# Altium schematic sheet Fluid_RTD_FE.SchDoc
size A4; SheetNumber: 4; SheetTotal: 5
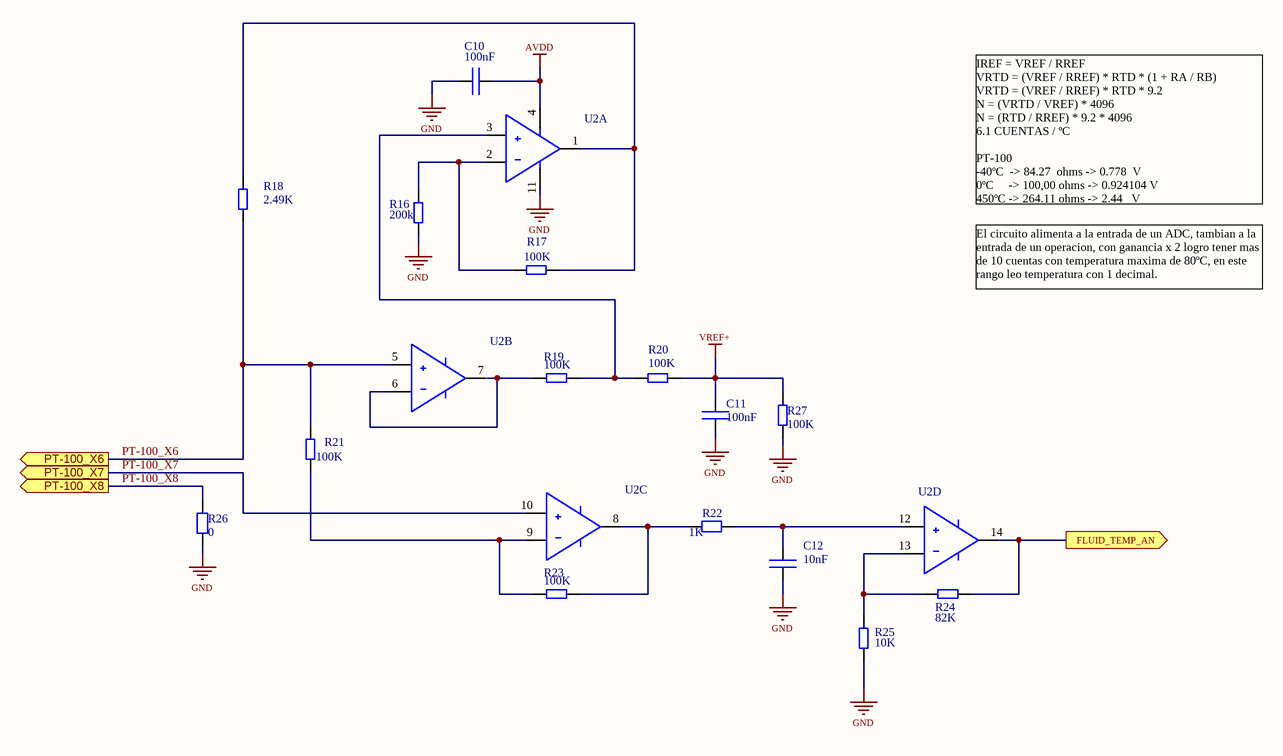
[diagram p0: Fluid_RTD_FE.SchDoc]

## Parts
C10  100nF  [CAP_SM0603_YAGEOCC2_N]
C11  100nF  [CAP_SM0603_YAGEOCC2_N]
C12  10nF  [CAP_SM0603_YAGEOCC2_N]
R16  200k  [RES_SM0603_YAGEORC_N]
R17  100K  [RES_SM0603_YAGEORC_N]
R18  2.49K  [RES_SM0603_YAGEORC_N]
R19  100K  [RES_SM0603_YAGEORC_N]
R20  100K  [RES_SM0603_YAGEORC_N]
R21  100K  [RES_SM0603_YAGEORC_N]
R22  1K  [RES_SM0603_YAGEORC_N]
R23  100K  [RES_SM0603_YAGEORC_N]
R24  82K  [RES_SM0603_YAGEORC_N]
R25  10K  [RES_SM0603_YAGEORC_N]
R26  0  [RES_SM0603_YAGEORC_N]
R27  100K  [RES_SM0603_YAGEORC_N]
U2  GS8044  [GS8044-SR]  (value not drawn)  (parts A,B,C,D of 4)

## Ports
FLUID_TEMP_AN (out), PT-100_X6 (out), PT-100_X7 (out), PT-100_X8 (out)

## Nets
AVDD: C10.1 U2.4(V+)
GND: C10.2 C11.2 C12.2 R16.1 R25.1 R26.1 R27.1 U2.11(GND)
VREF+: C11.1 R20.2 R27.2
FLUID_TEMP_AN: R24.2 U2.14(OUT) ; port FLUID_TEMP_AN
PT-100_X6: R18.1 R21.2 U2.5(IN+) ; port PT-100_X6
PT-100_X7: U2.10(IN+) ; port PT-100_X7
PT-100_X8: R26.2 ; port PT-100_X8
NetC12_1: C12.1 R22.2 U2.12(IN+)
NetR16_2: R16.2 R17.1 U2.2(IN-)
NetR17_2: R17.2 R18.2
NetR19_1: R19.1 U2.6(IN-)
NetR19_2: R19.2 R20.1 U2.3(IN+)
NetR21_1: R21.1 R23.1 U2.9(IN-)
NetR22_1: R22.1 R23.2 U2.8(OUT)
NetR24_1: R24.1 R25.2 U2.13(IN-)

Not connected (* = marked no-connect by the designer): U2 1(OUT) 7(OUT)

## Notes on the sheet
- IREF = VREF / RREF
  VRTD = (VREF / RREF) * RTD * (1 + RA / RB)
  VRTD = (VREF / RREF) * RTD * 9.2
  N = (VRTD / VREF) * 4096
  N = (RTD / RREF) * 9.2 * 4096
  6.1 CUENTAS / ºC
  PT-100
  -40ºC  -> 84.27  ohms -> 0.778  V
  0ºC     -> 100,00 ohms -> 0.924104 V
  450ºC -> 264.11 ohms -> 2.44   V
- El circuito alimenta a la entrada de un ADC, tambian a la entrada de un operacion, con ganancia x 2 logro tener mas de 10 cuentas con temperatura maxima de 80ºC, en este rango leo temperatura con 1 decimal.

## Library data of the parts
C10 C11 = CC0603KRX7R9BB104: CAP 100nF SM0603 X7R 50V YAGEO CC2; Tolerance (%): 10; Voltage Rating (Volts): 50; Category: Capacitor; Manufacturer: Yageo; Manufacturer Part Number: CC0603KRX7R9BB104; Package: 0603; Value: 100nF; Supplier Part Number 1: 1362556; Supplier 1: Farnell; ComponentLink1URL: http://www.yageo.com; ComponentLink1Description: Manufacturer Website; Supplier 2: Digi-Key; Supplier Part Number 2: 311-1344-1-ND; Datasheet: https://datasheet.lcsc.com/lcsc/2211101700_YAGEO-CC0603KRX7R9BB104_C14663.pdf
C12 = CC0603KRX7R9BB103: CAP 10nF SM0603 X7R 50V YAGEO CC2; Tolerance (%): 10; Voltage Rating (Volts): 50; Category: Capacitor; Manufacturer: Yageo; Manufacturer Part Number: CC0603KRX7R9BB103; Package: 0603; Value: 10nF; Supplier Part Number 1: 722236; Supplier 1: Farnell; ComponentLink1URL: http://www.yageo.com; ComponentLink1Description: Manufacturer Website; Supplier 2: Digi-Key; Supplier Part Number 2: 311-1085-1-ND
R16 = RC0603FR-07200KL: RES 200K SM0603 YAGEO RC_L; Power (Watts): 0.1; Resistance (Ohms): 200000; Tolerance (%): 1; Category: Resistor; Manufacturer: Yageo; Manufacturer Part Number: RC0603FR-07200KL; Package: 0603; Value: 200k; ComponentLink1URL: http://www.yageo.com; ComponentLink1Description: Manufacturer Website
R17 R19-R21 R23 R27 = RC0603FR-13100KL: RES 100K SM0603 YAGEO RC_L; Power (Watts): 0.1; Resistance (Ohms): 100000; Tolerance (%): 1; Category: Resistor; Manufacturer: Yageo; Manufacturer Part Number: RC0603FR-13100KL; Package: 0603; Value: 100K; Supplier Part Number 1: 2309107; Supplier 1: Farnell; ComponentLink1Description: Manufacturer Website; ComponentLink1URL: http://www.yageo.com; Supplier 2: Digi-Key
R18 = RC0603FR-072K49L: RES 2K49 SM0603 YAGEO RC_L; Power (Watts): 0.1; Resistance (Ohms): 2490; Tolerance (%): 1; Category: Resistor; Manufacturer: Yageo; Manufacturer Part Number: RC0603FR-072K49L; Package: 0603; Value: 2.49K; ComponentLink1URL: http://www.yageo.com; ComponentLink1Description: Manufacturer Website; Datasheet: https://www.yageo.com/upload/media/product/app/datasheet/rchip/pyu-rc_group_51_rohs_l.pdf
R22 = RC0603FR-071KL: RES 1K SM0603 YAGEO RC_L; Power (Watts): 0.1; Resistance (Ohms): 1000; Tolerance (%): 1; Category: Resistor; Manufacturer: Yageo; Manufacturer Part Number: RC0603FR-071KL; Package: 0603; Value: 1K; Supplier Part Number 1: 9238484; Supplier 1: Farnell; ComponentLink1URL: http://www.yageo.com; ComponentLink1Description: Manufacturer Website; Supplier 2: Digi-Key; Supplier Part Number 2: 311-1.00KHRCT-ND
R24 = RC0603FR-0782KL: RES 82K SM0603 YAGEO RC_L; Power (Watts): 0.1; Resistance (Ohms): 82000; Tolerance (%): 1; Category: Resistor; Manufacturer: Yageo; Manufacturer Part Number: RC0603FR-0782KL; Package: 0603; Value: 82K; Supplier Part Number 1: 9238719; Supplier 1: Farnell; ComponentLink1Description: Manufacturer Website; ComponentLink1URL: http://www.yageo.com; Supplier 2: Digi-Key; Supplier Part Number 2: 311-82.0KHRCT-ND
R25 = RC0603FR-0710KL: RES 10K SM0603 YAGEO RC_L; Power (Watts): 0.1; Resistance (Ohms): 10000; Tolerance (%): 1; Category: Resistor; Manufacturer: Yageo; Manufacturer Part Number: RC0603FR-0710KL; Package: 0603; Value: 10K; Supplier Part Number 1: 9238603; Supplier 1: Farnell; ComponentLink1Description: Manufacturer Website; ComponentLink1URL: http://www.yageo.com; Supplier 2: Digi-Key; Supplier Part Number 2: 311-10.0KHRCT-ND
R26 = RC0603FR-070RL: RES 0 OHMS SM0603 YAGEO RC_L; Power (Watts): 0.1; Tolerance (%): 1; Category: Resistor; Manufacturer: Yageo; Manufacturer Part Number: RC0603FR-070RL; Package: 0603; Resistance (Ohms): 0; Value: 0; Supplier Part Number 1: 9238484; Supplier 1: Farnell; ComponentLink1URL: http://www.yageo.com; ComponentLink1Description: Manufacturer Website; Supplier 2: Digi-Key; Supplier Part Number 2: 311-1.00KHRCT-ND; Datasheet: https://www.yageo.com/upload/media/product/app/datasheet/rchip/pyu-rc_group_51_rohs_l.pdf
U2 = GS8044-SR: IC OPAMP GP 4 CIRCUIT 14SOIC; Manufacturer: Gainsil; Vendor: LCSC; Manufacturer Part Number: GS8044-SR; Vendor Part Number: *